# Altium schematic sheet Strain-Maxim.SchDoc
size 297 x 209 mm; SheetNumber: 5; SheetTotal: 5; SheetTitle: Strain Gauge Frontend
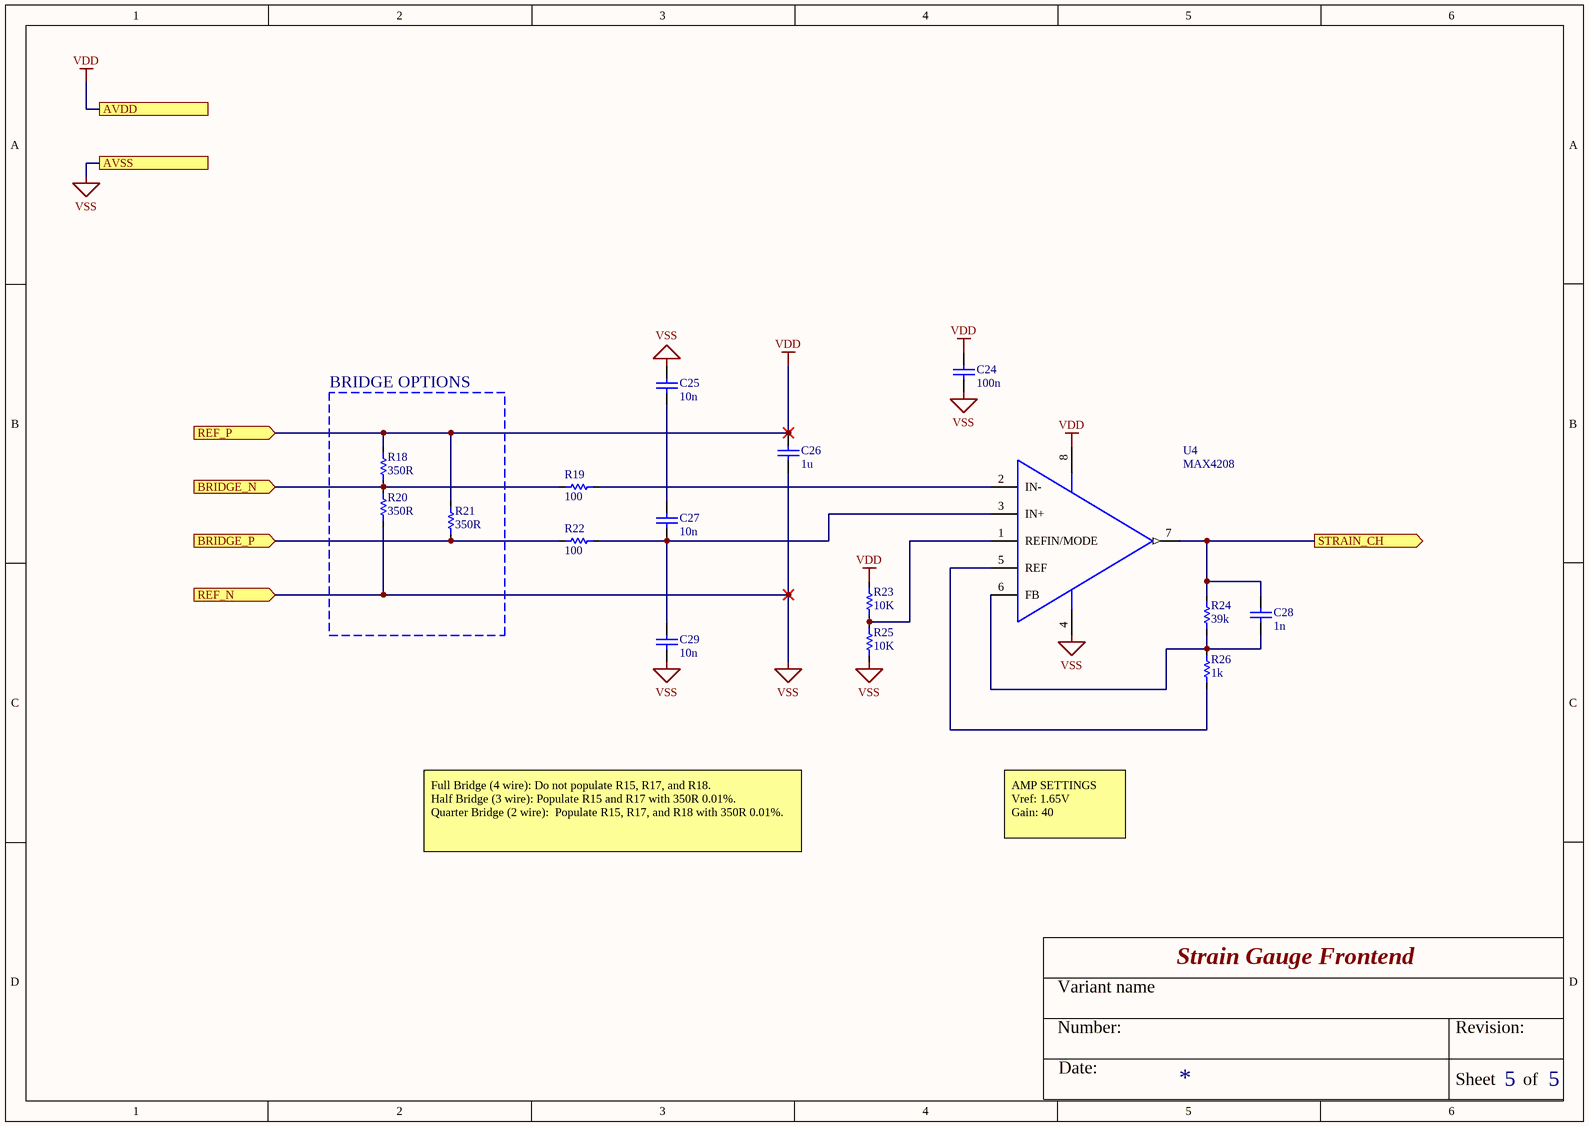
[diagram p0: Strain-Maxim.SchDoc]

## Parts
C24  100n  [CAP_0603_M]
C25  10n  [CAP_0603_M]
C26  1u  [CAP_0603_M]
C27  10n  [CAP_0603_M]
C28  1n  [CAP_0603_M]
C29  10n  [CAP_0603_M]
R18  350R  [RES_0603_M]
R19  100  [RES_0603_M]
R20  350R  [RES_0603_M]
R21  350R  [RES_0603_M]
R22  100  [RES_0603_M]
R23  10K  [RES_0603_M]
R24  39k  [RES_0603_M]
R25  10K  [RES_0603_M]
R26  1k  [RES_0603_M]
U4  MAX4208  [MAX4208_SOP127P600-8N]

## Blocks framed on the sheet
BRIDGE OPTIONS: R18 R20 R21

## Ports
AVDD, AVSS, BRIDGE_N (in), BRIDGE_P (in), REF_N (in), REF_P (in), STRAIN_CH (out)

## Nets
VDD: C24.2 C26.2 R18.2 R21.2 R23.2 U4.8(V+) ; port REF_P, port AVDD
VSS: C24.1 C25.2 C26.1 C29.1 R20.1 R25.1 U4.4(V-) ; port REF_N, port AVSS
BRIDGE_N: R18.1 R19.1 R20.2 ; port BRIDGE_N
BRIDGE_P: R21.1 R22.1 ; port BRIDGE_P
STRAIN_CH: C28.2 R24.2 U4.7(VO) ; port STRAIN_CH
NetC25_1: C25.1 C27.2
NetC27_1: C27.1 C29.2 R22.2 U4.3(IN+)
NetC28_1: C28.1 R24.1 R26.2 U4.6(FB)
NetR19_2: R19.2 U4.2(IN-)
NetR23_1: R23.1 R25.2 U4.1(REFIN/MODE)
NetR26_1: R26.1 U4.5(REF)

## Notes on the sheet
- Full Bridge (4 wire): Do not populate R15, R17, and R18.
  Half Bridge (3 wire): Populate R15 and R17 with 350R 0.01%.
  Quarter Bridge (2 wire):  Populate R15, R17, and R18 with 350R 0.01%.
- AMP SETTINGS
  Vref: 1.65V
  Gain: 40
- Variant name
- Number:
- Date:
- Revision:
- Sheet
- of

## Library data of the parts
C24-C29 = CAP_0603: CAP Cnom Vcap Ptol Dial 0603; Category: capacitor; Created: 2018-07-01; Created By: JS; Last Modified: 2018-07-01
R18-R26 = RES_0603: RES OPT 1/5W 0603; Manufacturer: *; Manufacturer PN: *; Category: resistor; Created: 2018-07-01; Last Modified: 2018-07-01; Created By: JS
U4 = MAX4208: Manufacturer: Maxim; Manufacturer PN: MAX4208